# EAGLE board TLog_HighSpeedADC (EAGLE 8.3.0)
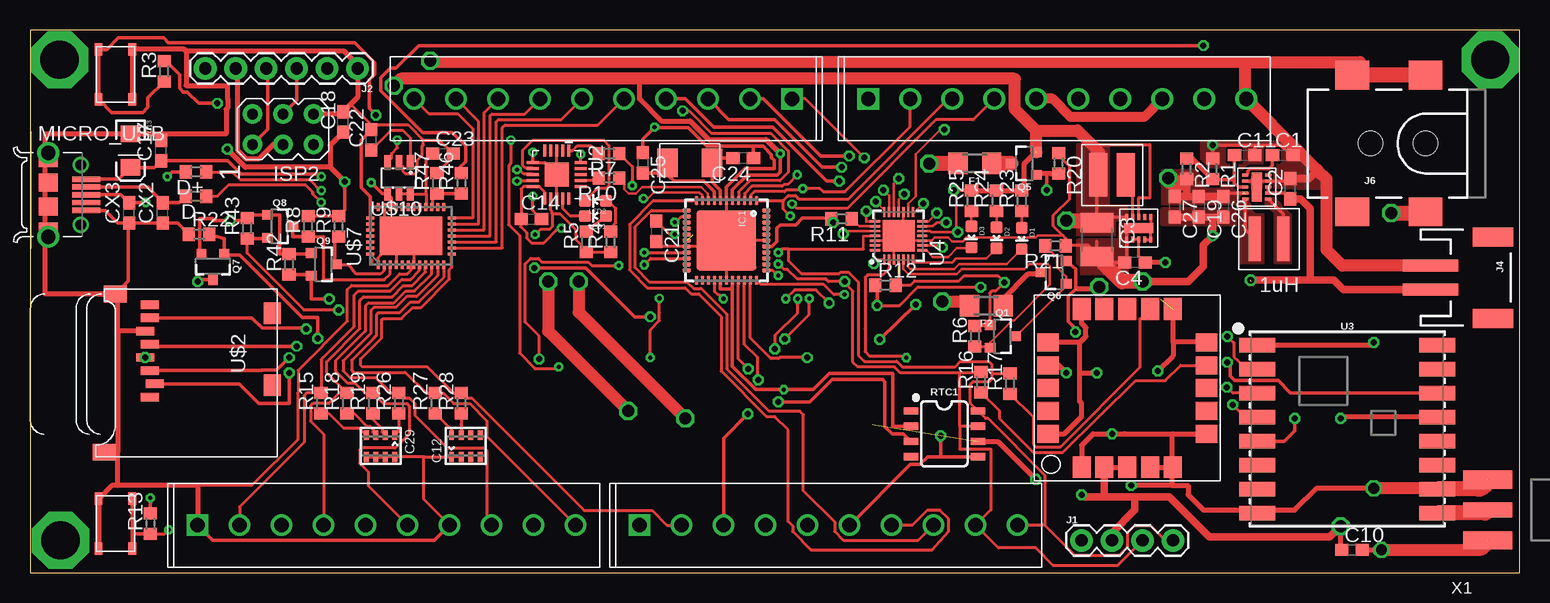
[diagram p7: board, top side]
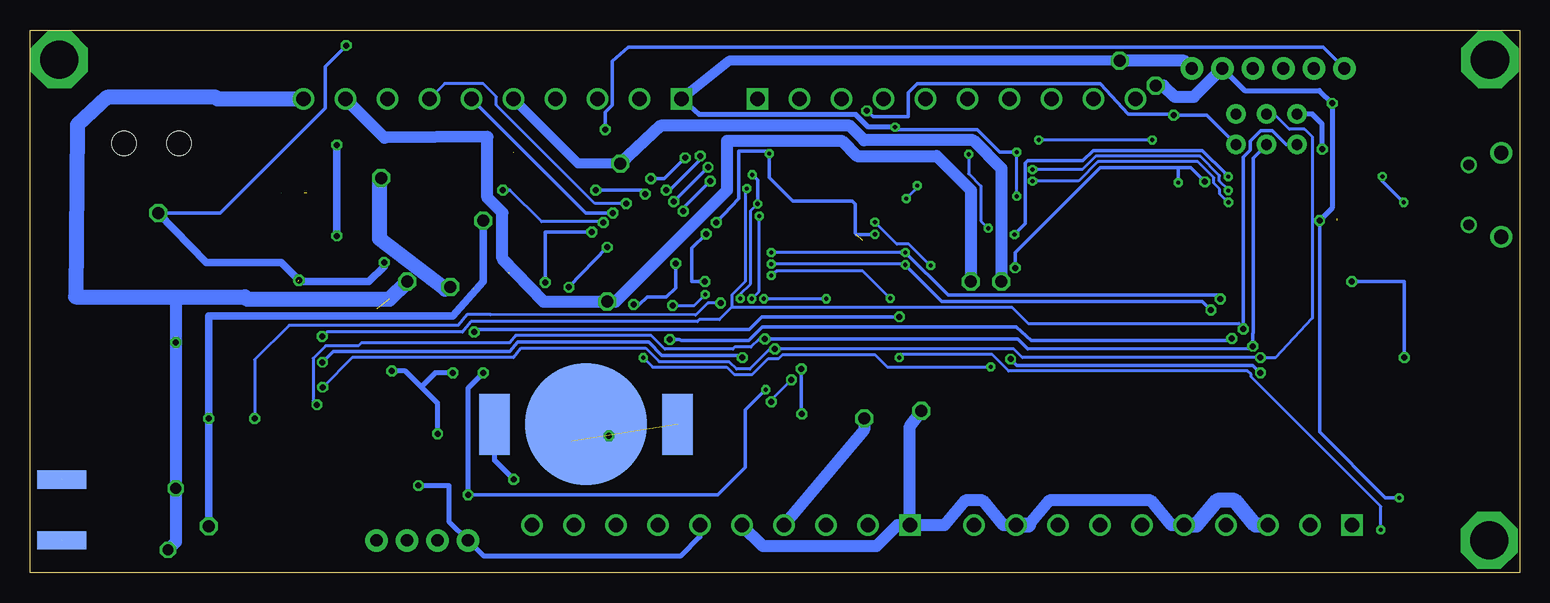
[diagram p8: board, bottom side, seen from below]

Size 124.13 x 45.27 mm. Coordinates in mm from the lower left corner, seen from the top.
Outline: 0,0 124.13,0 124.13,45.27 0,45.27 0,0
Copper layers (1*16): Top 0.0178mm / dielectric 59mil / Bottom 0.0178mm
Design rules "SSC-EAGLE-2Lyr_v1.0.0.3 *": minimum track width 8mil, minimum drill 14mil, track to track 8mil, track to pad 8mil, pad to pad 8mil, via to via 8mil, smd to smd 8mil, copper to edge 20mil, drill to drill 16mil, minimum pad ring 8mil, minimum via ring 8mil, stop-mask expansion 2.5mil, vias tented up to drill 0mil, thermal gap 10mil

## Footprints (pad centres in the part's own frame; a part is rotated, then mirrored left to right if it is on the bottom)
LINX_BAT-HLD-012-SMT = smd 10.16 x 10.16: GND 0,0 | smd 2.54 x 5.08: POWER0 -7.62,0; POWER1 7.62,0
C0603 = smd 1.1 x 1: 1 -0.85,0; 2 0.85,0
C1210 = smd 1.6 x 2.7: 1 -1.4,0; 2 1.4,0
CECJ-1206 = smd 0.406 x 0.813: A1 -1.2,-0.9; A2 -1.2,0.9; B1 -0.4,-0.9; B2 -0.4,0.9; C1 0.4,-0.9; C2 0.4,0.9; D1 1.2,-0.9; D2 1.2,0.9
EIA3216 = smd 1.4 x 1.6: A 1.4,0; C -1.4,0
LED-0603 = smd 1 x 1: A 0,-0.877; C 0,0.877
R0603 = smd 1 x 1.1: 1 -0.85,0; 2 0.85,0
1206 = smd 1.6 x 1.8: 1 -1.4,0; 2 1.4,0
MLF44-TH = smd 0.7 x 0.3: 1 -3.325,2.5; 2 -3.325,2; 3 -3.325,1.5; 4 -3.325,1; 5 -3.325,0.5; 6 -3.325,0; 7 -3.325,-0.5; 8 -3.325,-1; 9 -3.325,-1.5; 10 -3.325,-2; 11 -3.325,-2.5; 23 3.325,-2.5; 24 3.325,-2; 25 3.325,-1.5; 26 3.325,-1; 27 3.325,-0.5; 28 3.325,0; 29 3.325,0.5; 30 3.325,1; 31 3.325,1.5; 32 3.325,2; 33 3.325,2.5 | smd 0.3 x 0.7: 12 -2.5,-3.325; 13 -2,-3.325; 14 -1.5,-3.325; 15 -1,-3.325; 16 -0.5,-3.325; 17 0,-3.325; 18 0.5,-3.325; 19 1,-3.325; 20 1.5,-3.325; 21 2,-3.325; 22 2.5,-3.325; 34 2.5,3.325; 35 2,3.325; 36 1.5,3.325; 37 1,3.325; 38 0.5,3.325; 39 0,3.325; 40 -0.5,3.325; 41 -1,3.325; 42 -1.5,3.325; 43 -2,3.325; 44 -2.5,3.325 | smd 5 x 5: TH 0,0
AVRISP = drill 0.9 pad 1.626: 1 -1.27,2.54; 2 1.27,2.54; 3 -1.27,0; 4 1.27,0; 5 -1.27,-2.54; 6 1.27,-2.54
1X04 = drill 1.016 pad 1.88: 1 0,0; 2 2.54,0; 3 5.08,0; 4 7.62,0
1X06 = drill 1.016 pad 1.88: 1 0,0; 2 2.54,0; 3 5.08,0; 4 7.62,0; 5 10.16,0; 6 12.7,0
JST-2-SMD = smd 1 x 4.6: 1 -1,-3.7; 2 1,-3.7 | smd 1.6 x 3.4: NC1 -3.4,1.5; NC2 3.4,1.5
SCREWTERMINAL-3.5MM-10 = drill 1.2 square: P$1 0,0 | drill 1.2: P$2 3.5,0; P$3 7,0; P$4 10.5,0; P$5 14,0; P$6 17.5,0; P$7 21,0; P$8 24.5,0; P$9 28,0; P$10 31.5,0
POWER_JACK_SMD = smd 2.8 x 2.4: GND 0,-5.7; P$4 6.1,-5.7; VIN0 0,5.7; VIN1 6.1,5.7 | hole 2.032: 0,0; 4.572,0
WE-LQS(INDUCTOR) = smd 1.5 x 3.6: P$1 -1.15,0; P$2 1.15,0
10118194-0001LF_LONGER_PADS = smd 0.45 x 2.35: 1 -1.3,3.175; 2 -0.65,3.175; 3 0,3.175; 4 0.65,3.175; 5 1.3,3.175 | drill 0.9: P$6 -2.5,2.7; P$7 2.5,2.7 | drill 1.2: P$8 -3.5,0; P$9 3.5,0 | smd 1.5 x 1.55: P$10 -1,0; P$11 1,0; P$12 -3.05,0; P$13 3.05,0
SOT23-3 = smd 0.8 x 0.9: 1 -0.95,-1; 2 0.95,-1; 3 0,1.1
SO08 = smd 0.6 x 1.2: 1 -1.905,-2.8; 2 -0.635,-2.8; 3 0.635,-2.8; 4 1.905,-2.8; 5 1.905,2.8; 6 0.635,2.8; 7 -0.635,2.8; 8 -1.905,2.8
QFN20 = smd 1 x 0.25: 1 -2.032,0.968; 2 -2.032,0.468; 3 -2.032,-0.032; 4 -2.032,-0.532; 5 -2.032,-1.032; 11 1.968,-1.032; 12 1.968,-0.532; 13 1.968,-0.032; 14 1.968,0.468; 15 1.968,0.968 | smd 0.25 x 1: 6 -1.032,-2.032; 7 -0.532,-2.032; 8 -0.032,-2.032; 9 0.468,-2.032; 10 0.968,-2.032; 16 0.968,1.968; 17 0.468,1.968; 18 -0.032,1.968; 19 -0.532,1.968; 20 -1.032,1.968 | smd 2 x 2: 21 -0.032,-0.032
RFM69HCW-XXXS2 = smd 3 x 1.2: 1 -7.5,7; 2 -7.5,5; 3 -7.5,3; 4 -7.5,1; 5 -7.5,-1; 6 -7.5,-3; 7 -7.5,-5; 8 -7.5,-7; 9 7.5,-7; 10 7.5,-5; 11 7.5,-3; 12 7.5,-1; 13 7.5,1; 14 7.5,3; 15 7.5,5; 16 7.5,7
QFN-28 = smd 0.85 x 0.2: 1 -1.975,1.2; 2 -1.975,0.8; 3 -1.975,0.4; 4 -1.975,0; 5 -1.975,-0.4; 6 -1.975,-0.8; 7 -1.975,-1.2; 15 1.975,-1.2; 16 1.975,-0.8; 17 1.975,-0.4; 18 1.975,0; 19 1.975,0.4; 20 1.975,0.8; 21 1.975,1.2 | smd 0.2 x 0.85: 8 -1.2,-1.975; 9 -0.8,-1.975; 10 -0.4,-1.975; 11 0,-1.975; 12 0.4,-1.975; 13 0.8,-1.975; 14 1.2,-1.975; 22 1.2,1.975; 23 0.8,1.975; 24 0.4,1.975; 25 0,1.975; 26 -0.4,1.975; 27 -0.8,1.975; 28 -1.2,1.975 | smd 2.65 x 2.65: 29 0,0
CRYSTAL_5X3.2_2-SMD = smd 1.7 x 2.4: P$1 -1.85,0; P$2 1.85,0
MICROSD = smd 0.7 x 1.5: 1 9,-10.64; 2 7.9,-10.24; 3 6.8,-10.64; 4 5.7,-11.04; 5 4.6,-10.64; 6 3.5,-11.04; 7 2.4,-10.64; 8 1.3,-10.64 | smd 1.8 x 1.4: CD1 2,-0.44; CD2 8,-0.44 | smd 1.4 x 1.9: MT1 0.4,-13.54; MT2 13.6,-14.44
WSON-10 = smd 0.5 x 0.25: P$1 -0.95,1; P$2 -0.95,0.5; P$3 -0.95,0; P$4 -0.95,-0.5; P$5 -0.95,-1; P$6 0.95,-1; P$7 0.95,-0.5; P$8 0.95,0; P$9 0.95,0.5; P$10 0.95,1 | smd 0.84 x 2.4: P$11 0,0
SKRPABE010_(SWITCH) = smd 1.05 x 0.65: P$1 -2.075,1.4; P$2 2.075,1.4; P$3 2.075,-1.4; P$4 -2.075,-1.4
SAM-M8Q = smd 1.5 x 1.8: 1 -3.8,-6.6; 2 -1.9,-6.6; 3 0,-6.6; 4 1.9,-6.6; 5 3.8,-6.6; 11 3.8,6.6; 12 1.9,6.6; 13 0,6.6; 14 -1.9,6.6; 15 -3.8,6.6 | smd 1.8 x 1.5: 6 6.6,-3.8; 7 6.6,-1.9; 8 6.6,0; 9 6.6,1.9; 10 6.6,3.8; 16 -6.6,3.8; 17 -6.6,1.9; 18 -6.6,0; 19 -6.6,-1.9; 20 -6.6,-3.8
QFN38-5X7 = smd 0.7 x 0.25: 1 -2.4,2.75; 2 -2.4,2.25; 3 -2.4,1.75; 4 -2.4,1.25; 5 -2.4,0.75; 6 -2.4,0.25; 7 -2.4,-0.25; 8 -2.4,-0.75; 9 -2.4,-1.25; 10 -2.4,-1.75; 11 -2.4,-2.25; 12 -2.4,-2.75; 20 2.4,-2.75; 21 2.4,-2.25; 22 2.4,-1.75; 23 2.4,-1.25; 24 2.4,-0.75; 25 2.4,-0.25; 26 2.4,0.25; 27 2.4,0.75; 28 2.4,1.25; 29 2.4,1.75; 30 2.4,2.25; 31 2.4,2.75 | smd 0.25 x 0.7: 13 -1.5,-3.4; 14 -1,-3.4; 15 -0.5,-3.4; 16 0,-3.4; 17 0.5,-3.4; 18 1,-3.4; 19 1.5,-3.4; 32 1.5,3.4; 33 1,3.4; 34 0.5,3.4; 35 0,3.4; 36 -0.5,3.4; 37 -1,3.4; 38 -1.5,3.4 | smd 3.2 x 5.2: EXP 0,0
WE-MAIA(4.1X4.1) = smd 0.98 x 3.7: P$1 -1.185,0; P$2 1.185,0
SOT23-6L = smd 0.55 x 1.2: 1 -0.95,-1.3; 2 0,-1.3; 3 0.95,-1.3; 4 0.95,1.3; 5 0,1.3; 6 -0.95,1.3
SSOP16 = smd 0.419 x 1.143: 1 -2.223,-2.6; 2 -1.587,-2.6; 3 -0.953,-2.6; 4 -0.318,-2.6; 5 0.318,-2.6; 6 0.953,-2.6; 7 1.587,-2.6; 8 2.223,-2.6; 9 2.223,2.6; 10 1.587,2.6; 11 0.953,2.6; 12 0.318,2.6; 13 -0.318,2.6; 14 -0.953,2.6; 15 -1.587,2.6; 16 -2.223,2.6
SMA_EDGELAUNCH = smd 4.064 x 1.524: GND@1 2.032,-2.54; GND@2 2.032,2.54 | smd 4.064 x 1.524 bottom: GND@3 2.032,2.54; GND@4 2.032,-2.54 | smd 4.064 x 1.27: P 2.032,0

## Placement (x,y rotation side)
BT1  LINX-BAT-HLD-012-SMT-OTL  [LINX_BAT-HLD-012-SMT]  77.79,12.38 0 bottom
C1  0.1uF  [C0603]  104.39,34.83 0 top
C2  10uF  [C0603]  105.03,32.04 90 top
C3  22uF  [C1210]  88.9,27.78 270 top
C4  2.2uF  [C0603]  92.08,25.88 180 top
C10  0.1uF  [C0603]  110.17,1.9 0 top
C11  10pF  [C0603]  101.22,34.83 0 top
C12  10nF  [CECJ-1206]  36.32,10.57 0 top
C13  10uF  [EIA3216]  8.38,35.21 270 top
C14  0.1uF  [C0603]  41.78,29.5 0 top
C17  0.1uF  [C0603]  10.92,35.21 90 top
C18  .1uF  [C0603]  26.1,37.59 90 top
C19  22uF  [C0603]  97.41,30.51 270 top
C21  1uF  [C0603]  52.2,28.48 270 top
C22  0.1uF  [C0603]  28.45,36.1 90 top
C23  0.1uF  [C0603]  34.42,34.96 0 top
C24  [C0603]  59.44,34.58 180 top
C25  [C0603]  51.05,34.19 270 top
C26  22uF  [C0603]  99.44,30.51 270 top
C27  22uF  [C0603]  95.38,30.51 270 top
C29  10nF  [CECJ-1206]  29.21,10.57 180 top
CX2  33pF  [C0603]  11.05,30 90 top
CX3  33pF  [C0603]  8.25,30 90 top
D1  [LED-0603]  82.65,27.88 180 top
D2  [LED-0603]  80.55,27.94 180 top
D3  [LED-0603]  78.45,28 180 top
D+  27ohm  [R0603]  13.84,33.43 180 top
D-  27ohm  [R0603]  13.84,31.4 180 top
F1  6V/0.5A  [1206]  78.74,34.13 180 top
F2  6V/0.5A  [1206]  79.69,22.26 180 top
IC1  ATMEGA644M  [MLF44-TH]  58.04,27.72 270 top
ISP2  AVRISP-6  [AVRISP]  21.08,36.99 90 top
J1  [1X04]  87.63,2.7 0 top
J2  [1X06]  27.3,42.07 180 top
J4  [JST-2-SMD]  120.41,24.61 270 top
J5  [SCREWTERMINAL-3.5MM-10]  63.5,39.53 180 top
J6  5.5x2.1mm Barrel  [POWER_JACK_SMD]  116.28,35.8 180 top
J8  [SCREWTERMINAL-3.5MM-10]  13.97,3.97 0 top
J9  [SCREWTERMINAL-3.5MM-10]  50.8,3.97 0 top
J10  [SCREWTERMINAL-3.5MM-10]  69.85,39.53 0 top
L2  10uH  [WE-LQS(INDUCTOR)]  90.17,33.18 180 top
LED1  Yellow  [LED-0603]  47.12,29.75 90 top
LED2  Blue  [LED-0603]  47.12,31.02 90 top
MICRO_USB  10118194-0001LF_LONGER_PADS  [10118194-0001LF_LONGER_PADS]  1.52,31.53 270 top
Q1  220mA/50V/3.5Ω  [SOT23-3]  81.03,19.72 270 top
Q5  4.3A/20V/54mΩ  [SOT23-3]  82.87,34.13 90 top
Q6  4.3A/20V/54mΩ  [SOT23-3]  85.34,25.05 90 top
Q7  4.3A/20V/54mΩ  [SOT23-3]  15.24,25.56 180 top
Q8  220mA/50V/3.5Ω  [SOT23-3]  20.8,28.89 270 top
Q9  220mA/50V/3.5Ω  [SOT23-3]  24.45,25.72 270 top
R1  143k  [R0603]  98.55,33.69 270 top
R2  953k  [R0603]  96.39,33.69 270 top
R3  10k  [R0603]  11.18,41.81 90 top
R4  1k  [R0603]  48.39,27.59 90 top
R5  1k  [R0603]  46.35,27.59 90 top
R6  10k  [R0603]  78.74,19.72 90 top
R7  1k  [R0603]  48.26,34.96 180 top
R8  10k  [R0603]  23.18,28.89 90 top
R9  10k  [R0603]  25.72,28.89 90 top
R10  1k  [R0603]  48.26,32.92 180 top
R11  10k  [R0603]  67.63,29.53 180 top
R12  10k  [R0603]  71.28,23.97 0 top
R13  10k  [R0603]  10.03,4.1 90 top
R15  10k  [R0603]  24.26,14.13 90 top
R16  FB  [R0603]  79.25,15.91 90 top
R17  FB  [R0603]  81.66,15.78 90 top
R18  10k  [R0603]  26.42,14.13 90 top
R19  10k  [R0603]  28.58,14.13 90 top
R20  10k  [R0603]  85.73,34.13 270 top
R21  10k  [R0603]  85.47,27.27 180 top
R22  10k  [R0603]  14.1,28.23 0 top
R23  330  [R0603]  82.65,31.04 90 top
R24  330  [R0603]  80.55,31.04 90 top
R25  330  [R0603]  78.45,31.04 90 top
R26  10k  [R0603]  30.73,14.13 90 top
R27  10k  [R0603]  33.78,14.13 90 top
R28  10k  [R0603]  35.94,14.13 90 top
R42  10k  [R0603]  21.59,25.72 90 top
R43  10k  [R0603]  18.1,28.73 90 top
R46  10k  [R0603]  35.94,32.48 90 top
R47  10k  [R0603]  33.91,32.48 90 top
RTC1  DS3231M  [SO08]  76.2,11.59 270 top
U2  FT231X-Q  [QFN20]  43.94,33.18 270 top
U3  915MHz  [RFM69HCW-XXXS2]  109.78,11.99 0 top
U4  SX1509  [QFN-28]  72.39,28.1 90 top
U$1  CRYSTAL_5X3.2_2LEAD  [CRYSTAL_5X3.2_2-SMD]  54.99,34.19 0 top
U$2  MICROSD  [MICROSD]  20.64,23.65 270 top
U$3  TPS63061  [WSON-10]  102.23,32.16 180 top
U$4  TPS6217X  [WSON-10]  92.39,28.73 90 top
U$5  SKRPABE010  [SKRPABE010_(SWITCH)]  7.11,4.1 90 top
U$6  SAM-M8Q  [SAM-M8Q]  91.44,15.4 0 top
U$7  LTC2495  [QFN38-5X7]  31.75,28.1 90 top
U$8  1uH  [WE-MAIA(4.1X4.1)]  103.25,27.84 180 top
U$9  SKRPABE010  [SKRPABE010_(SWITCH)]  7.11,41.56 270 top
U$10  MAX6070  [SOT23-6L]  30.73,32.92 180 top
U$15  LTC2440  [SSOP16]  -11.94,-2.13 0 top  (outside the outline)
X1  [SMA_EDGELAUNCH]  123.51,5.24 180 top

## Tracks (layer width: path | path; a pad name or v marks a point on that pad's centre or on a via)
3.3V  (via drill 0.35, 0.5, 0.5 pad 0.2, 1)  (3 unrouted)
  Top 0.203: U4.18 72.39,31.11 v72.87,31.59 | U4.4 72.39,23.97 | v77.31,28.42 77.17,28.43 77.17,31.89 | 77.31,28.5 v77.31,28.42 | U4.12 75.01,28.5 75.09,28.42 v77.31,28.42
  Top 0.254: U$4.P$8 92.39,31.27 93.34,31.27 93.34,35.72 89.02,35.72 | 72.39,23.97 73.34,23.97 73.71,24.34 77.42,24.34 77.85,24.78 80.65,24.78 v81.2,24.21 80.48,23.49 80.16,23.49 79.96,23.29 79.96,20.6 | R6.2 79.93,20.57 79.96,20.6 | 79.96,20.6 Q1.1 | v53.72,28.23 53.3,28.23 C21.1
  Top 0.305: U$4.P$10 89.4,29.68 C3.1 88.9,29.37 88.9,33.18 L2.P$2 89.02,34.45 89.02,35.15 89.02,35.72 | RTC1.2 71.91,12.22 71.91,16.61 66.61,16.61 65.26,15.27 v62.81,15.27 60.48,15.27 58.54,17.21 58.54,23.65 | Q9.1 23.45,26.57 R42.2 20.8,26.57 20.8,29.84 Q8.1 18.1,29.84 R43.2 18.1,29.37 v16.67,29.37 15.24,29.37 | Q7.2 14.13,26.56 14.13,29.53 15.24,29.53 | R25.2 78.32,31.91 v76.99,31.91 77.17,31.89 | 72.39,23.97 R12.2 | R11.2 66.94,29.37 v66.94,29.21 66.79,29.53 66.11,29.57 64.36,29.57 63.8,29.02 62.51,29.02 62.23,28.73 62.23,27.62 61.82,27.22 IC1.38 | 58.54,23.65 IC1.29 | IC1.27 57.54,23.65 58.54,23.65 | IC1.5 | 58.56,31.04 IC1.5 | v62.52,34.95 62.52,33.42 62.28,33.18 59.78,33.18 58.54,31.94 IC1.5 | v15.62,39.15 14.06,39.15 13.12,40.08 12.79,40.08 12.46,40.41 12.46,41.56 11.35,42.66 R3.2 | v10.03,6.25 R13.2
  Top 0.406: 50.8,41.21 50.8,40.08 50.81,40.07 50.81,39.52 52.64,37.68 55.02,37.68 56.57,36.13 61.34,36.13 v62.52,34.95 | R24.2 R25.2 R23.2 82.87,31.81 82.87,34.13 83.82,35.08 | C10.1 109.22,2.01 v109.22,3.89 | U3.13 109.22,12.99 v109.22,12.86 | 89.31,6.35 89.54,6.58 | U$6.2 U$6.3 | U$6.17 85.73,17.3 v86.36,16.67
  Top 0.61: v109.22,3.89 108.33,3.02 98.27,3.02 94.93,6.35 92.08,6.35 | 92.08,6.35 89.31,6.35 87.79,6.35 v87.63,6.51 | J1.2 90.17,3.33 92.08,5.24 92.08,6.35 | 89.54,6.58 U$6.2
  Top 1.016: v30.32,40.64 30.89,41.21 50.8,41.21 82.07,41.21 82.07,38.65 83.87,36.87 | Q5.2 83.87,36.87 | 83.87,36.87 87.3,36.87 89.02,35.15
  Top 1.27: v86.36,29.37 88.9,29.37 | 89.02,34.98 89.02,34.45
  Bottom 0.305: J2.2 | v16.67,29.37 16.67,11.75 11.18,6.25 v10.03,6.25 | v72.87,31.59 73.18,31.91 v76.99,31.91 | v81.2,24.21 81.2,28.42 v77.31,28.42 | v66.94,29.21 65.09,31.22 65.09,35.16 62.74,35.16 v62.52,34.95 62.52,32.96 60.58,31.02 55.63,31.02 55.37,30.77 55.37,28.31 55.28,28.23 v53.72,28.23 | v62.81,15.27 64.52,13.57 64.52,8.79 66.8,6.51 v87.63,6.51
  Bottom 0.406: J2.2 22.92,40.22 16.69,40.22 v15.62,39.15 15.62,30.42 v16.67,29.37 | v86.36,16.67 87.63,15.4 v87.63,6.51
  Bottom 0.61: v109.22,3.89 v109.22,12.86 109.22,21.43 88.9,21.43 86.36,24.29 v86.36,29.37
  Bottom 1.016: v30.32,40.64 29.69,40.64 28.73,39.69 27.15,39.69 J2.2
  pour Top (rank 2, no thermals): 91.44,28.1 87.31,28.1 87.31,35.72 89.85,35.72 89.85,30.64 91.44,30.64
3.3V_EXT_CTRL  (via drill 0.5)
  Top 0.203: U4.13 75.24,28.9 75.56,29.21 75.87,29.21 v76.36,29.19
  Top 0.305: v84.73,31.91 84.73,33.28 85.09,33.28
  Top 0.406: R20.2 85.09,33.28 83.87,33.28 Q5.1
  Bottom 0.254: 84.14,31.91 81.5,29.27 76.36,29.27 v76.36,29.19
  Bottom 0.305: 84.14,31.91 v84.73,31.91
5V  (via drill 0.35, 0.5, 1)  (2 unrouted)
  Top 0.254: U$7.29 30.33,30.5 U$7.28
  Top 0.305: R8.2 R9.2 26.23,30.25 v26.23,32.61 | v42.04,25.43 46.32,25.43 50.4,21.35 v51.67,21.35 | v87.12,20.08 87.12,20.36 86.53,20.95 86.53,23.07 87.15,23.68 87.15,25.32 Q6.2 | C26.1 99.73,31.65 101.06,31.65 | v28.45,32.54 29.37,31.62 U$10.4 30.1,31.31 30.1,30.88 30.33,30.65 30.33,30.5
  Top 0.406: 25.02,33.81 v26.23,32.61 | v16.45,35.32 17.96,33.81 25.02,33.81 | v89.09,23.84 88.93,23.68 87.2,23.68 | C18.1 25.02,35.66 25.02,33.81
  Top 0.61: 96.59,31.36 C27.1 | 96.59,31.36 C19.1 C26.1 | R2.2 96.39,31.55 96.59,31.36
  Top 1.27: v94.87,32.92 94.87,32.8 95,32.8 95,32.67 95.12,32.54 96.1,32.54 R2.2
  Bottom 0.305: v51.67,21.35 62.95,21.35 63.14,21.35 64.2,20.3 86.9,20.3 v87.12,20.08 | v42.04,25.43 42.04,26.7 34.94,33.8 28.45,33.8 | v26.23,32.61 27.42,33.8 28.45,33.8 | 28.45,33.8 v28.45,32.54
  Bottom 0.406: v16.45,35.32 16.45,37.43 17.27,38.26 ISP2.2
  Bottom 1.27: v89.09,23.84 89.28,23.72 89.54,23.65 95,27.84 95,32.8 v94.87,32.92
  pour Top (rank 2, no thermals): 101.6,31.91 100.58,31.91 100.58,32.16 100.2,32.54 97.41,32.54 97.41,33.56 94.36,33.56 94.36,30.51 100.46,30.51 100.46,31.27 101.6,31.27
5V_EXT_CTRL
  Top 0.2: 81.92,25.32 81.99,25.32 82.01,25.31 82.05,25.32 82.87,25.32 83.3,25.75 84.82,25.75 85,25.58 85,24.03 82.02,21.05 81.86,21.05 80.03,19.22 Q1.2
  Top 0.203: U4.5 72.79,25.32 73.18,24.92 77.23,24.92 77.47,25.16 77.63,25.32 | 77.63,25.32 81.92,25.32 | 77.63,25.32 | 77.63,25.32 | 77.63,25.32
  Top 0.254: R6.1 79.93,18.87 Q1.2
ADC0
  Top 0.254: U$7.8 32.46,25.66 32.46,25.21 31.71,24.47 30.99,24.47 30,23.48 27.35,23.48 27.03,23.17 27.03,20.55 24.26,17.77 R15.2 23.05,14.98 22.84,14.76 22.84,10.88 17.47,5.52 J8.P$2
ADC1
  Top 0.254: U$7.9 32.96,25.66 32.96,25.07 31.84,23.95 31.12,23.95 30.19,23.02 27.8,23.02 27.49,22.7 27.49,20.36 24.71,17.58 24.71,16.68 R18.2 25.77,14.98 24.9,14.11 23.57,14.11 23.38,13.92 23.38,12.64 24.47,11.55 J8.P$4
ADC2
  Top 0.254: U$7.10 33.46,25.66 33.46,24.93 32.03,23.49 31.3,23.49 30.32,22.51 28.19,22.51 27.94,22.26 27.94,20.16 25.45,17.67 25.45,16.85 26.49,15.81 27.1,15.81 27.93,14.98 R19.2 29.45,14.11 31.42,14.11 31.61,13.92 31.61,11.6 30.42,10.41 27.67,10.41 27.48,10.22 27.48,9.13 28.19,8.41 28.19,7.24 J8.P$6
ADC3
  Top 0.254: U$7.11 34,24.82 32.22,23.03 31.38,23.03 30.48,22.13 28.65,22.13 28.4,21.88 28.4,20.35 | 28.4,20.35 | 28.4,20.35 28.4,19.97 26.09,17.67 26.09,16.85 26.68,16.27 28.8,16.27 30.09,14.98 R26.2 31.15,14.57 31.61,14.57 32.07,14.1 32.07,13.12 34.78,10.41 37.86,10.41 38.05,10.22 38.05,4.38 J8.P$8
ADC4
  Top 0.203: U$7.12 34.5,25.59 34.53,25.56
  Top 0.254: 34.5,25.59 34.5,24.67 32.41,22.58 31.68,22.58 30.78,21.67 29.01,21.67 28.85,21.52 28.85,19.78 28.59,19.52 | 28.59,19.52 | 28.59,19.52 26.8,17.73 26.8,16.92 27,16.72 31.27,16.72 33.01,14.98 R27.2 34.42,14.98 35.29,14.11 36.63,14.11 38.05,12.68 38.05,11.38 J8.P$10
ADC5
  Top 0.254: U$7.13 35.15,25.5 34.96,25.3 34.96,24.48 32.59,22.12 31.88,22.12 30.95,21.19 29.41,21.19 29.31,21.09 29.31,19.59 27.56,17.84 27.56,17.3 27.68,17.18 33.1,17.18 35.3,14.98 R28.2 36.35,14.57 36.82,14.57 46.18,5.2 51.84,5.2 53.07,3.97 J9.P$2
ADC6
  Top 0.254: U$7.14 39.37,27.1 39.37,37.12 39.6,37.34 47.32,37.34 J5.P$5
ADC7
  Top 0.254: U$7.15 38.86,27.6 38.86,37.62 39.04,37.8 44.27,37.8 J5.P$6
ADC8
  Top 0.254: U$7.16 38.35,28.1 38.35,38.13 38.48,38.26 41.23,38.26 J5.P$7
ADC9
  Top 0.254: U$7.17 37.85,28.6 37.85,38.37 J5.P$8
ADC10
  Top 0.254: U$7.18 37.39,29.1 37.39,37.64 J5.P$9
ADC11
  Top 0.254: U$7.19 35.17,29.62 36.93,29.62 36.93,37.01 35.69,38.26 33.27,38.26 J5.P$10
BATT+  (via drill 0.5, 0.55, 1)  (2 unrouted)
  Top 0.254: U$4.P$2 U$4.P$3 92.39,26.41 C4.1
  Top 0.305: 92.71,25.88 C4.1 | v97.79,43.97 32.38,43.97 30.48,42.07 30,42.07 29.21,41.27 29.21,40.23 32.74,36.7 35.2,36.7 36.3,35.6 36.3,34.31 35.69,33.7 R46.2 | C2.1 104.54,31.67 U$3.P$2 | U$3.P$2 U$3.P$3
  Top 0.406: v94.62,25.88 92.71,25.88 | 106.68,24.41 106.69,24.4
  Top 0.61: J4.2 109.45,23.61 108.66,24.4 106.69,24.4 v101.73,24.4 | C2.1 105.88,31.19 106.68,30.38 106.68,24.41
  Top 1.27: v113.43,30 115.11,30.02 J6.VIN0
  Bottom 0.305: v113.43,30 108.27,30 99.54,38.73 99.54,42.23 v97.79,43.97
  Bottom 0.61: 101.76,24.29 95.89,24.29 94.62,25.56 v94.62,25.88 | v113.43,30 109.46,25.88 103.2,25.88 v101.73,24.4
EXT_3.3V  (via drill 1)
  Top 0.813: 77.58,34.13 F1.2 | J10.P$8 92.84,38.02 86.73,38.02 85.22,39.53 J10.P$5
  Top 1.016: v43.18,24.29 43.18,20.16 v49.85,13.49
  Top 1.27: F1.2 v74.93,34.13
  Bottom 0.813: 74.95,34.13 78.45,34.13 J10.P$5
  Bottom 1.016: v74.93,34.13 74.95,34.13 71.57,37.27 55.82,37.27 54.63,36.08 45.54,36.08 43.18,33.72 v43.18,24.29 | v49.85,13.49 50.8,12.23 J9.P$1 | J8.P$5 29.01,3.97 30.75,6.04 39.19,6.04 40.93,3.97 | J8.P$9 43.01,3.97 44.75,6.04 46.19,6.04 47.93,3.97 J9.P$1 | J9.P$5 63.06,2.23 53.58,2.23 51.84,3.97 J9.P$1
  Bottom 1.27: J8.P$3 22.01,3.97 23.75,6.04 25.19,6.04 26.93,3.97 J8.P$5 | 40.93,3.97 J8.P$9
EXT_5V  (via drill 1)
  Top 1.016: v45.72,24.29 45.72,21.75 v54.61,12.86 | v76.04,22.62 78.29,22.62 F2.2
  Bottom 1.016: v45.72,24.29 45.72,31.91 48.58,34.77 55.22,34.77 56.49,36.04 66.04,36.04 66.04,31.91 75.33,22.62 v76.04,22.62 81.34,22.62 84.77,26.22 84.77,30.03 86.02,31.27 86.02,36.35 94.6,36.27 J10.P$9 | v54.61,12.86 54.61,11.93 J9.P$4
EXT_D6  (via drill 0.5)
  Top 0.203: U4.15 73.73,30.07 v74.45,30.8
  Bottom 0.254: v74.45,30.8 77.05,30.8 85.26,39.01 85.26,39.7 86.36,40.8 89.58,40.8 J10.P$7
EXT_INT  (via drill 0.5)
  Top 0.254: v59.85,17 59.04,17.81 IC1.30
  Top 0.305: J9.P$3 57.8,11.22 v59.82,13.24
  Bottom 0.305: v59.85,17 59.85,13.27 v59.82,13.24
GND  (via drill 0.35, 0.5, 0.5 pad 0.2, 0.9, 0.9 pad 0.2, 1)  (3 unrouted)
  Top 0.152: 42.02,34.21 U2.6
  Top 0.2: 83.48,27.94 83.81,27.94 84,28.13 86.08,28.13 | 86.08,28.13
  Top 0.203: U4.26 71.99,27.7 U4.3 | 72.79,27.7 U4.10 75.17,27.7 75.41,27.94 76.52,27.94 76.84,27.62 77.71,27.62 78.03,27.94 83.48,27.94 | U4.17 72.79,28.5
  Top 0.254: U$4.P$6 93.39,28.73 U$4.P$5 U$4.P$4 | 31.75,25.7 U$7.6 | 31.75,25.7 U$7.7 32,27.85 | 30.5,26.81 U$7.4 | U$7.1 29,26.27 30.83,28.1 | U$7.30 29.5,28.1 | 31.75,25.7 31.75,25.24 31.43,24.92 30.8,24.92 29.85,23.97 26.81,23.97 26.45,23.61 26.45,20.99 22.35,16.89 22.35,15.04 22.3,14.98 22.3,11.1 18.47,7.27 13.97,7.27 | C29.D2 C29.C2 C29.B2 C29.A2 32.83,9.67 | C12.B1 C12.A1 32.83,9.67 | J8.P$7 32.83,6.11 32.83,9.67 | 58.04,27.2 IC1.TH | 58.04,27.2 IC1.28 | IC1.39 IC1.TH | 58.04,27.2 58.02,27.22 IC1.18 52.61,27.22 C21.2 | IC1.6 IC1.TH | R20.1 85.73,34.8 86.61,33.92 86.61,31.14 85.28,29.82 85.28,28.92 86.08,28.13 86.32,27.88 R21.1 88.22,27.27 88.9,26.59 | U2.6 42.91,34.21 43.81,33.31 | 43.81,33.31 U2.21 | 43.91,33.41 U2.3 | 43.91,33.41 43.81,33.31 | U2.13 43.91,33.41 | R47.2 35.27,34.69 C23.2 34.12,36.1 32.78,36.1 | 26.74,39.08 28.45,37.37 C22.2 28.87,37.37 31.51,37.37 32.78,36.1 | U$10.2 31.08,33.88 31.08,33.49 31.27,33.29 32.1,33.29 32.29,33.49 32.29,34.43 32.69,34.83 32.69,35.59 32.78,35.69 32.78,36.1 | C14.2 41.91,30.22 v41.91,31.4
  Top 0.305: 93.39,28.73 U$4.P$11 91.39,28.73 U$4.P$1 91.38,26.35 C4.2 89.41,25.88 C3.2 88.9,26.59 88.9,27.62 | 30.5,26.81 30.48,26.83 U$7.EXP | 32,27.85 U$7.EXP | 30.83,28.1 U$7.EXP | U$7.30 U$7.31 28.35,30.5 | 28.35,30.5 U$7.32 U$7.33 U$7.34 | 29.5,28.1 U$7.EXP | U$2.MT2 7.3,10.05 | 7.3,23.02 7.1,23.02 U$2.MT1 8.17,24.33 8.17,29.15 | 75.88,9.68 RTC1.5 | J8.P$7 33.7,2.7 15.24,2.7 J8.P$1 | U4.29 72.39,27.7 71.99,27.7 U4.29 | 72.79,27.7 U4.29 | 72.79,28.5 U4.29 | 75.88,9.68 v75.88,11.43 | C2.2 104.81,32.67 U$3.P$4 | 105.75,35.13 105.45,34.83 C1.2 105.1,34.83 104.24,35.69 102.07,35.69 | R1.1 v98.55,35.69 102.07,35.69 | C11.2 102.07,35.69 | U$3.P$7 102.23,32.66 | U$3.P$4 102.23,32.66 | 102.23,32.66 U$3.P$11 | J9.P$6 73.36,9.03 74.15,9.03 74.8,9.68 75.88,9.68 | IC1.6 58.04,32.16 59.57,33.69 62.01,33.69 62.01,34.42 61.79,34.64 61.79,34.89 61.11,35.57 60.29,35.57 | C25.1 51.05,36.17 v52.05,37.17 52.37,37.17 52.41,37.13 54.85,37.13 56.41,35.57 60.28,35.57 60.29,35.57 | C24.1 60.29,35.57 | R22.1 12.32,29.15 CX2.1 CX3.1 8.17,29.15 | 8.17,29.15 7.33,29.15 6.25,30.23 MICRO_USB.5 | U2.6 v41.91,35.08 | 28.35,30.5 28.35,31.38 27.59,32.14 27.59,36.09 C22.2
  Top 0.406: U3.8 102.64,5.24 arc90 U3.8 | 95.15,7.27 v91.76,7.27 | 95.15,7.27 96.52,7.27 96.52,6.51 97.79,5.24 102.28,5.24 | 7.3,20.15 7.3,10.05 7.3,7.27 | 7.3,20.15 7.3,23.02 | U$2.6 7.3,20.15 | 5.67,23.25 U$2.MT1 1.27,23.25 1.27,36.61 C13.C 10.97,36.61 | C10.2 v112.63,1.9 | 13.02,43.5 26.19,43.5 27.3,42.39 J2.1 27.3,39.65 26.74,39.08 C18.2 25.92,38.26 ISP2.6 | 13.02,43.5 13.02,40.64 16.45,40.64 16.45,39.54 16.48,39.5 16.48,38.79 16.35,38.66 16.35,36.61 10.97,36.61 | v111.98,7.05 107.24,7.05 105.41,5.24 102.28,5.24 | 102.28,5.24 U3.8 | U3.1 111.98,18.99 v111.98,19.21 | 95.15,8.71 U$6.5 U$6.4 | 95.15,8.71 95.15,7.27 | U$6.11 95.25,21.75 95.25,19.24 | U$6.16 84.86,19.22 87.47,19.22 | U$6.15 87.64,20.78 87.98,20.44 87.98,19.73 87.48,19.22 87.47,19.22 | U$6.20 86.2,11.6 87.63,13.03 87.63,14.13 87.47,14.29 87.47,16.67 | U$6.1 87.64,10.63 88.6,11.59 v90.17,11.59 91.2,11.59 91.2,11.6 95.25,11.6 | 87.47,16.67 87.47,19.22 | v93.98,16.82 95.25,18.09 95.25,19.24 | U$6.10 98,19.24 95.25,19.24 | 95.25,11.6 U$6.6 | 95.25,11.6 95.15,11.5 95.15,8.71 | 87.47,16.67 v88.9,16.67 | U$9.P$2 U$9.P$1 8.53,43.65 12.86,43.65 13.02,43.5 | U$5.P$1 U$5.P$2 6.82,7.27 7.3,7.27 | J8.P$1 13.97,7.27 7.3,7.27 | C17.2 10.97,36.11 10.97,36.61
  Top 0.61: v92.71,24.29 96.52,24.29 97.79,25.56 97.79,27.34 v98.55,28.1 98.55,29.59 98.48,29.66 | C2.2 106.57,32.89 107.28,33.6 | 98.48,29.66 C19.2 C27.2 | 98.48,29.66 C26.2
  Top 1.016: v33.34,42.7 33.93,42.58 101.28,42.58 | J6.P$4 110.84,42.58 101.28,42.58 | 101.28,42.58 101.28,39.6 J10.P$10 105.75,35.13 107.28,33.6 108.04,32.84 108.04,26.92 109.36,25.61 J4.1 | v112.63,1.9 120.68,1.9 arc90 X1.GND@2 | U3.10 arc90 117.21,7.05 v111.98,7.05
  Top 1.27: v92.71,24.29 90.99,24.29 89.41,25.88 | J6.GND J6.P$4 | X1.GND@1 arc-90 120.68,6.99 U3.10
  Bottom 0.254: v41.91,31.4 v41.91,35.08
  Bottom 0.305: v75.88,11.43 77.79,11.43 BT1.GND | v41.91,35.08 43.33,35.08 45.19,36.94 51.82,36.94 v52.06,37.18
  Bottom 0.406: v91.76,7.27 89.22,7.27 89.22,4.29 J1.1 86.36,1.43 69.85,1.43 68.3,2.98 J9.P$6 | J10.P$1 68.38,38.22 55.3,38.22 54.26,37.18 v52.06,37.18 v52.05,37.17 | v93.98,16.82 92.86,16.82 91.54,15.49 | v90.17,11.59 90.17,14.13 91.54,15.49 | v88.9,16.67 90.36,16.67 91.54,15.49
  Bottom 0.61: 111.98,22.8 111.76,23.02 | v98.55,28.1 v98.55,35.69
  Bottom 0.813: v33.34,42.7 65.88,42.7 J10.P$1
  Bottom 1.016: v33.34,42.7 27.94,42.7 J2.1 | 111.98,22.8 v111.98,19.21 v111.98,7.05 111.98,2.56 v112.63,1.9
  Bottom 1.27: v92.71,24.29 94.18,22.82 106.02,22.82 106.22,23.02 120.33,23.02 120.17,37.35 117.71,39.66 108.62,39.66 108.5,39.53 J10.P$10
  pour Top (no thermals): 87.31,27.78 90.81,27.78 90.81,29.05 91.44,29.05 91.44,24.92 87.31,24.92
  pour Top (no thermals): 101.09,33.56 100.84,33.81 97.66,33.81 97.66,35.97 105.28,35.97 108.33,32.04 101.09,32.04
  pour Top (no thermals): 94.36,30.38 100.46,30.38 100.46,28.99 94.36,28.99
GPIO_EXT1  (via drill 0.5)
  Top 0.203: U4.19 71.99,32.46 v72.39,32.86
  Top 0.254: v69.53,34.61 64.61,39.53 J5.P$1
  Bottom 0.305: v72.39,32.86 71.28,32.86 v69.53,34.61
GPIO_EXT2  (via drill 0.5)
  Top 0.203: U4.20 71.59,31.44 v71.12,31.91
  Top 0.305: v68.26,34.77 65.88,34.77 61.12,39.53 J5.P$2
  Bottom 0.305: v71.12,31.91 70.8,31.91 68.26,34.45 v68.26,34.77
GPIO_EXT3  (via drill 0.5)
  Top 0.203: U4.21 71.19,30.25 v70.48,30.96
  Top 0.305: v67.63,33.81 66.04,33.81 62.07,37.78 58.25,37.78 J5.P$3
  Bottom 0.305: v70.48,30.96 v67.63,33.81
GPIO_EXT4  (via drill 0.5)
  Top 0.203: U4.22 69.69,29.3 v69.69,30.16
  Top 0.305: v67.43,32.66 66.4,32.66 61.91,37.15 56.99,37.15 54.61,39.53 J5.P$4
  Bottom 0.305: v69.69,30.16 69.61,30.48 v67.43,32.66
LED1
  Top 0.2: 80.45,25.74 81.39,25.74 D1.C
  Top 0.203: U4.6 73.19,25.5 73.34,25.34 77.03,25.34 77.43,25.74 80.45,25.74
LED2
  Top 0.2: D2.C 79.68,26.19 79.28,26.19
  Top 0.203: U4.7 73.59,26.1 73.82,25.88 76.84,25.88 77.16,26.19 79.28,26.19
LED3
  Top 0.203: U4.8 74.7,26.9 75.25,26.35 76.5,26.35 77.22,27.07 78.59,27.07 D3.C
  Top 0.305: D3.C 78.43,26.9
LOG_INT  (via drill 0.35)
  Top 0.254: R13.1 11.21,3.25 v11.56,3.59 | v51.69,17.94 51.69,20.26 52.46,21.03 52.46,21.68 52.45,21.68 v52.45,22.89 | v62.36,24.78 62.11,25.03 62.06,25.03 61.88,25.22 IC1.34
  Top 0.305: 8.51,3.22 U$5.P$3 | 8.51,3.22 U$5.P$4 | R13.1 8.51,3.25 8.51,3.22
  Bottom 0.254: v11.56,3.59 11.56,5.53 22.37,16.34 22.37,16.56 22.63,16.82 42.57,16.82 43.94,18.19 51.44,18.19 v51.69,17.94 | v52.45,22.89 54.74,25.18 61.92,25.18 62.06,25.03 62.11,25.03 v62.36,24.78
MISO  (via drill 0.35, 0.5)
  Top 0.254: J10.P$2 73.35,37.22 67.91,31.78 66.11,31.78 65.85,32.04 v64.39,32.04 64.29,31.93 63.02,31.93 62.87,31.78 60.35,31.78 60.06,31.49 60.06,31.06 IC1.2 | v99.78,19.72 100.32,19.18 100.32,18.01 101.71,16.75 U3.2
  Top 0.305: U$2.7 18.5,21.25 19.35,20.4 22.94,20.4 v23.02,20.32 | U3.2 102.28,16.83 | J2.4 19.81,42.07 19.81,36.99 ISP2.1
  Bottom 0.254: v99.78,19.72 99.42,20.08 88.1,20.08 87.39,20.95 68.51,20.95 68.36,21.11 66.68,21.11 65.64,22.15 | 65.64,22.15 42.31,22.15 40.96,20.8 23.39,20.8 23.02,20.42 v23.02,20.32 | v64.39,32.04 64.53,31.89 64.53,24.29 65.64,23.18 65.64,22.15
  Bottom 0.305: ISP2.1 19.43,35.72 20.6,36.89 21.57,36.89 22.45,36 22.45,35.23 23.02,34.67 v23.02,20.32
MOSI  (via drill 0.35, 0.5, 0.5 pad 0.2)
  Top 0.254: J10.P$3 76.53,39.53 68.19,31.19 64.08,31.19 63.79,31.47 63.21,31.47 62.79,31.06 62.79,31.01 | v99.74,15.48 100.23,14.99 U3.3 | IC1.1 62.76,31.04 62.79,31.01 | v63.98,22.85 63.98,21.68 62.11,19.82 62.11,18.7 v62.06,18.65 | v63.37,29.75 62.79,30.32 62.79,31.01
  Top 0.305: v21.59,17.94 20.56,16.91 19.35,16.91 19.3,16.85 U$2.3 | 102.25,14.75 U3.3 | J2.3 22.23,39.4 ISP2.4
  Bottom 0.254: ISP2.4 20.45,38.26 19.18,36.99 17.91,36.99 17.27,36.35 17.27,21.24 20.32,17.94 v21.59,17.94 41.42,17.94 42.14,18.65 v62.06,18.65 62.47,18.65 64.14,16.99 65.25,16.99 65.88,17.62 71.71,17.62 72.82,18.73 83.23,18.73 83.85,17.94 97.28,17.94 v99.74,15.48 | v63.98,22.85 63.37,23.46 v63.37,29.75
MUX_INT  (via drill 0.35, 0.5)
  Top 0.203: U4.9 75.88,27.3 v76.04,27.15
  Top 0.254: v79.22,23.81 73.98,23.81 72.47,22.3 v70.59,22.3 | v67.87,23.2 66.98,23.2 66.14,24.05 60.88,24.05 IC1.33
  Top 0.305: R12.1 70.59,23.97 v70.59,22.3
  Bottom 0.254: v70.59,22.3 68.77,22.3 v67.87,23.2
  Bottom 0.305: v79.22,23.81 v76.04,27.15
N$1
  Top 0.305: U$3.P$10 101.29,28.63 U$8.P$2
  pour Top (rank 6, no thermals): 100.84,31.4 101.6,31.4 101.6,30.38 102.11,29.88 102.74,29.88 102.74,25.81 100.84,25.81
N$2
  Top 0.254: U$4.P$9 91.89,32.96
  Top 0.305: 91.89,32.96 91.88,32.97 91.88,33.18 L2.P$1
N$3
  Top 0.305: U$3.P$1 104.44,29.91 U$8.P$1
  pour Top (rank 6, no thermals): 102.87,31.4 103.51,31.4 105.03,29.88 105.03,25.81 103.76,25.81 103.76,30 102.87,30.89
N$4
  Top 0.305: U$3.P$6 101.46,33.34 101.46,33.51 101.67,33.72 103.28,33.72 103.51,33.94 103.51,34.79 C1.1
N$5
  Top 0.305: IC1.7 57.53,31.05 57.53,31.91 56.84,32.6 U$1.P$2 57.35,34.58 C24.2
N$6
  Top 0.305: C11.1 100.37,32.8 | 100.37,32.8 100.37,32.5 100.71,32.16 U$3.P$8 | 100.37,32.8 98.59,32.8 R1.2
  Top 0.406: R2.1 96.85,34.54 R1.2
N$7  (via drill 3.17)
  other vias: 121.68,42.78
N$8
  Top 0.305: U$1.P$1 53.14,33.12 53.72,32.67 56.13,32.67 57.02,31.78 57.02,31.06 IC1.8 | 52.97,34.23 U$1.P$1 | C25.2 52.29,33.34 U$1.P$1
N$11  (via drill 3.17)
  other vias: 2.46,42.78
N$12  (via drill 3.17)
  other vias: 2.54,2.7
N$13
  Top 0.254: U$7.27 U$7.26
N$14
  Top 1.27: Q5.3 F1.1
N$17
  Top 0.254: R28.1 35.92,12.41 C12.B2
N$18  (1 unrouted)
  Top 0.406: F2.1 81.09,22.83 83.2,24.94 84.16,24.94
N$19
  Top 0.254: C29.B1 29.34,11.74 29.34,12.02 28.58,12.78 R19.1
N$20
  Top 0.254: R16.1 80.78,13.52 80.78,12.89 83.61,10.06 86.07,10.06 92.17,16.03 94.62,16.03 95.88,17.3 U$6.9
N$21
  Top 0.254: U$6.12 92.52,21.18 92.52,17.16 85.88,10.52 83.8,10.52 83.61,10.71 83.61,12.98 R17.1
N$22
  Top 0.254: C22.1 30.11,36.91 31.07,36.91 31.68,36.3 U$10.1
N$23
  Top 0.254: U$10.5 U$10.6 31.97,31.59 33,31.59 | C23.1 33,34.39 33,31.59 | 33,31.59 U$7.23
N$24
  Top 0.254: R26.1 30.73,11.8 C29.A1
N$25
  Top 0.254: R10.2 47.2,32.71 U2.17
N$28
  Top 1.27: X1.P arc-90 121.22,4.99 U3.9
N$30
  Top 0.2: R21.2 85.59,26.3 85.59,25.47 86.34,24.72 86.34,24.18 Q6.1 86.34,23.93 Q1.3
N$31  (via drill 0.5)  (1 unrouted)
  Top 0.406: RTC1.6 80.65,10.95 v83.82,7.78
  Bottom 0.406: v83.82,7.78 85.41,9.37 BT1.POWER0
N$32
  Top 0.2: D1.A R23.1
N$33
  Top 0.2: D2.A R24.1
N$34
  Top 0.2: D3.A R25.1
N$35
  Top 0.254: U2.1 45.21,35.21 45.61,35.61 46.76,35.61 R7.2
N$36  (via drill 0.35)
  Top 0.305: MICRO_USB.3 7.58,31.53 CX3.2 8.29,30.89 v9.65,30.89 | v11.43,33.05 11.81,33.43 D+.2
  Bottom 0.305: v9.65,30.89 11.43,32.67 v11.43,33.05
N$37
  Top 0.305: MICRO_USB.2 9.85,32.18 CX2.2 12.45,30.85 D-.2
N$38  (via drill 0.35)
  Top 0.254: 14.99,33.43 D+.1 16.86,33.43 17.52,32.77 23.31,32.77 24.2,31.89 v24.29,31.89 | U2.8 41.87,33.25 41.13,33.25 40.75,33.63 v40.59,33.63
  Bottom 0.254: v40.59,33.63 36.44,33.63 35.33,34.74 26.62,34.74 25.02,33.13 25.02,33.05 25.02,32.67 24.29,31.94 v24.29,31.89
N$39  (via drill 0.35)
  Top 0.254: U2.20 v45.91,34.9 v45.9,34.9 | U2.11 42.91,31.74 42.44,32.21 U2.10 41.13,32.21 40.93,32.02 C14.1 40.89,29.5 40.89,28.86 41.38,28.37 41.38,27.92 41.8,27.5 42.8,27.5 44.03,28.73 v44.27,28.73
  Bottom 0.254: v45.9,34.9 45.9,33.28 44.88,32.26 44.88,29.34 v44.27,28.73
N$40
  Top 0.254: 48.1,31.12 LED2.A | 48.1,31.12 48.26,31.27 | R4.2 48.39,28.76 48.82,29.2 48.82,30.39 48.1,31.12
N$41
  Top 0.254: LED2.C 47.27,32.04 48.05,32.04 48.24,32.24 48.24,35.64 47.82,36.06 41.88,36.06 41.78,35.97 41.78,35.96 41.08,35.26 41.08,33.95 41.27,33.75 41.87,33.75 U2.7
N$42
  Top 0.254: R5.2 46.68,28.69 LED1.A
N$43
  Top 0.254: LED1.C 45.02,29.75 44.41,30.36 U2.14
N$44
  Top 0.254: R15.1 24.9,13.28 26.11,12.07 27.42,12.07 C29.D1
N$45
  Top 0.254: R18.1 27,13.28 28.07,12.21 28.35,12.21 28.54,12.02 28.54,11.74 C29.C1
N$46  (via drill 0.35)
  Top 0.254: D-.1 15.62,31.4 16.54,32.31 23,32.31 23.58,31.74 23.58,31.59 24.26,30.91 v24.26,30.89 | U2.9 41.87,32.67 v40.59,32.67
  Bottom 0.254: v40.59,32.67 36.75,32.67 35.14,34.28 26.82,34.28 25.48,32.94 25.48,32.48 24.99,32 24.99,31.59 24.58,31.18 24.54,31.18 v24.26,30.89
N$48
  Top 0.254: R27.1 35.12,11.94 C12.A2
N$52
  Top 0.254: U$7.25 U$7.24
N$54
  Top 0.254: U$7.22 33.5,31.47 R47.1
  Top 0.305: R46.1 R47.1
N$56
  Top 0.203: U4.23 69.11,28.9 R11.1
RADIO_CS  (via drill 0.35, 0.5, 0.5 pad 0.2)
  Top 0.254: v66.58,22.49 65.49,23.59 63.71,23.59 v62.97,22.85 | IC1.26 57.06,24.38 57.06,23.45 57.34,23.17 57.47,23.17 v57.78,22.85
  Top 0.305: v105.41,12.86 105.41,11.83 104.54,10.95 102.31,10.95 U3.5
  Bottom 0.254: v66.58,22.49 67.64,22.49 68.66,21.48 85.74,21.52 87.7,21.52 88.42,20.64 102.54,20.64 105.41,17.77 v105.41,12.86 | v62.97,22.85 v57.78,22.85
RADIO_INT  (via drill 0.5)
  Top 0.254: v64.77,17.94 62.46,17.94 62.39,17.87 61.74,17.87 60.04,19.57 IC1.32
  Top 0.305: U3.14 105.04,14.99 104,16.02 104.03,16.02 103.7,16.03 100.39,16.03 100.01,16.41 100.01,17.3 v99.76,17.56
  Bottom 0.305: v64.77,17.94 64.93,18.1 65.09,18.13 71.47,18.13 72.58,19.24 83.47,19.24 84.14,18.45 93.65,18.45 93.85,18.46 93.86,18.45 98.87,18.45 v99.76,17.56
REF_CTRL  (via drill 0.35)
  Top 0.254: U$10.3 30.13,34.57 30.13,34.96 30.61,35.44 v30.61,36.1 | U4.2 71.59,25.39 71.05,24.85 69.79,24.85 69.6,24.66 69.6,20.35 69.6,18.45 69.95,18.09 72.87,18.09 v73.03,17.94 | v40.08,36.1 40.08,34.12 39.88,33.92 39.88,29.03 40.8,28.12 40.8,18.33 42.04,17.08 42.04,17.05 42.07,17.05 42.09,17.03 43.92,17.03 v44.07,17.18
  Bottom 0.254: v73.03,17.94 72.25,17.16 66.07,17.16 65.44,16.53 63.95,16.53 62.6,17.87 61.74,17.87 61.41,18.2 53.72,18.2 52.7,17.18 v44.07,17.18 | v30.61,36.1 v40.08,36.1
RST  (via drill 0.5)
  Top 0.254: v54.39,38.52 54.94,38.52 56.79,36.66 61.71,36.66 63.21,35.17 63.21,33.42 62.48,32.7 59.98,32.7 59.06,31.78 59.06,31.06 IC1.4
  Top 0.305: v28.83,38.16 28.26,38.73 28.26,41.12 28.73,41.59 28.73,42.54 27.07,44.21 11.52,44.21 11.12,44.61 7.37,44.61 6.39,43.64 U$9.P$4 U$9.P$3 6.81,38.39 9.4,38.39 9.83,38.81 9.83,39.62 R3.1
  Bottom 0.305: ISP2.5 26.07,38.16 v28.83,38.16 28.76,38.23 32.6,38.23 34.94,40.8 50.17,40.8 50.92,40.05 50.92,38.02 53.86,38.02 53.96,38.11 54.3,38.43 v54.39,38.52
RTC_INT  (via drill 0.5)
  Top 0.254: v60.67,16.1 60.63,16.9 60.63,17.96 59.54,19.06 IC1.31
  Top 0.305: v62.36,14.26 64.99,14.26 66.84,16.1 71.05,16.1 71.25,15.91 71.25,12.17 71.85,11.57 72.79,11.57 RTC1.3
  Bottom 0.254: v60.67,16.1 62.36,14.41 v62.36,14.26
RX
  Top 0.2: R10.1 49.51,32.52 49.51,32.01 49.91,31.61 50.47,31.61 51.03,32.16 55.95,32.16 56.49,31.62 56.49,31.09 IC1.9
RX_EXT
  Top 0.254: J9.P$7 73.52,3.97 74.78,5.22 75.82,5.22 76.56,4.49 76.56,3.45 75.19,1.92 65.07,1.92 63.54,3.45 63.54,3.92 63.18,4.29 63.18,11.91 62.07,13.01 61.41,13.01 57.6,16.82 57.6,21.39 55.73,23.26 55.11,23.26 54.6,23.76 51.45,23.76 49.96,25.26 49.96,29.05 51.95,31.04 IC1.11
SCK  (via drill 0.35, 0.5)
  Top 0.254: J10.P$4 78.6,37.78 75.5,37.78 68.15,30.43 63.84,30.43 v63.5,30.77 | v100.22,14.02 101.25,12.99 U3.4 | v62.89,19.49 64.94,21.54 v64.94,22.88 | v63.94,33.19 63.13,32.39 62.83,32.39 62.68,32.24 60.17,32.24 59.56,31.63 59.56,31.06 IC1.3
  Top 0.305: U$2.5 10,18.89 v22.23,18.89
  Top 0.406: J2.5 17.32,41.76 17.32,35.21 18.04,34.5 19.05,34.5 20.27,35.72 ISP2.3
  Bottom 0.254: v62.89,19.49 63.37,19.49 64.06,18.81 65.41,18.81 65.56,18.65 71.23,18.65 72.39,19.81 83.63,19.81 84.14,19.18 96.52,19.18 96.77,18.93 99.5,18.93 100.54,17.88 100.54,14.34 v100.22,14.02 | v64.94,22.88 64.94,23.24 64.08,24.1 64.08,30.19 v63.5,30.77
  Bottom 0.305: v22.23,18.89 22.23,18.86 22.37,18.7 41,18.68 41.81,19.49 42.17,19.49 v62.89,19.49 | 22.23,19.59 v22.23,18.89 | v63.5,30.77 63.5,32.75 v63.94,33.19 | v22.23,18.89 22.23,19.97 22.21,19.98 22.21,34.59 ISP2.3
SCL  (via drill 0.35, 0.5)
  Top 0.203: U4.25 69.45,28.1 69.45,26.99
  Top 0.254: 94.62,2.7 93.34,3.97 92.08,3.97 91.44,3.33 91.44,2.14 90.73,1.43 87.1,1.43 84.6,3.93 84.6,3.97 | 84.6,3.97 84.6,8.1 79.85,12.85 79.64,12.85 RTC1.8 78.37,14.13 78.37,15.69 78.6,15.93 79.94,15.93 80.13,16.12 80.13,16.67 | 80.13,16.67 80.13,17.39 79.94,17.59 77.5,17.59 77.05,17.14 72.72,17.14 72.22,17.63 69.54,17.63 69.04,18.13 69.04,24.24 68.21,25.07 67.56,25.07 67.45,24.96 64.26,24.96 63.24,25.99 63.24,26.99 | 80.13,16.67 80.17,16.63 R17.2 | v51.18,26.7 54.7,26.7 IC1.19 | v62.36,26.7 62.64,26.99 63.12,26.99 | 63.24,26.99 63.12,26.99 | 63.24,26.99 69.45,26.99 | 63.12,26.99 | 84.6,3.97 J9.P$10
  Top 0.305: 94.62,2.7 J1.4 | R42.1 23.45,24.87 Q9.2 23.45,22.84 v24.93,22.84
  Bottom 0.254: v51.18,26.7 v62.36,26.7
  Bottom 0.305: v24.93,22.84 24.93,23.15 47.62,23.15 v51.18,26.7
SCL_HV
  Top 0.254: Q9.3 26.51,25.72 27.15,24.92 29.21,24.92 29.5,25.21 U$7.2
  Top 0.305: Q9.3 25.4,25.72 25.4,28.04 R9.1
SD_CS  (via drill 0.35, 0.5)
  Top 0.254: v42.42,17.81 42.42,19.74 41.25,20.9 41.25,25.76 41.71,26.21 42.36,26.21 42.66,25.91 46.52,25.91 46.8,25.63 v49.07,25.63 | IC1.13 54.69,29.7 54.27,29.7 53.81,29.24 v53.72,29.24
  Top 0.305: U$2.2 17.43,15.75 19.05,14.13 21.59,14.13 v21.59,16.67
  Bottom 0.254: v53.72,29.24 51.89,27.41 50.89,27.41 49.11,25.63 v49.07,25.63
  Bottom 0.305: v21.59,16.67 22.23,17.3 41.91,17.3 v42.42,17.81
SD_VCC  (via drill 0.5)
  Top 0.305: Q7.3 13.97,24.46 v13.97,24.29
  Bottom 0.305: v13.97,24.29 9.6,24.29 U$2.4
  other vias: 9.6,17.95
SD_VCC_CTRL  (via drill 0.5)
  Top 0.203: v70.33,25.8 70.33,26.12 U4.1
  Top 0.305: R22.2 16.19,27.88 Q7.1 16.24,26.51 17.46,26.51 22.7,21.27 23.97,21.27 v23.97,19.53 23.97,20 | v70.8,19.45 v73.82,22.38
  Bottom 0.305: v73.82,22.38 73.34,22.38 72.71,23.02 71.12,23.02 70.33,23.73 v70.33,25.8 | v23.97,19.53 24,19.37 40.69,19.37 41.93,20.48 63.13,20.48 64.24,19.37 69.85,19.37 | 69.85,19.37 69.86,19.37 | 69.85,19.37 70.01,19.45 v70.8,19.45
SDA  (via drill 0.35, 0.5)
  Top 0.203: U4.24 68.03,28.5 v67.79,28.26
  Top 0.254: RTC1.7 77.47,12.22 | 77.47,12.22 77.47,10.32 80.07,10.32 80.07,5.24 J9.P$9 80.7,2.06 83.82,2.06 85.25,0.63 90.65,0.63 J1.3 | 77.47,12.22 77.47,16.68 | v25.72,21.91 22.84,21.91 18.1,26.65 R43.1 | R16.2 79.17,16.68 77.47,16.68 | v51.18,25.69 51.71,26.22 IC1.20 | v62.36,25.74 62.61,25.49 62.65,25.49 62.84,25.3 63.12,25.3 63.92,24.51 66.33,24.51 66.55,24.29 v67.88,24.29 67.88,24.19 68.58,23.5 68.58,17.56 68.96,17.18 72.03,17.18 72.53,16.68 77.47,16.68
  Top 0.305: R43.1 19.8,27.88 Q8.2
  Bottom 0.254: v51.18,25.69 51.24,25.74 v62.36,25.74
  Bottom 0.305: v67.79,28.26 68.98,27.07 68.98,24.29 v67.88,24.29 | v25.72,21.91 26.45,22.64 48.13,22.64 v51.18,25.69
SDA_HV
  Top 0.254: R8.1 24.45,28.04 24.45,24.45 29.53,24.45 30,24.92 U$7.3
  Top 0.305: Q8.3 21.9,28.04 R8.1
SPI_EXT_CS1  (via drill 0.5)
  Top 0.203: 76.2,36.99 75.88,36.99 73.82,34.92 73.82,31.43 73.19,30.8 U4.16
  Top 0.305: 76.2,36.99 v76.2,36.97
  Bottom 0.305: v76.2,36.97 76.2,38.4 75.59,39.01 75.59,42.67 74.3,43.81 16.35,43.81 J2.6
SPI_EXT_CS2  (via drill 0.5)
  Top 0.203: U4.14 74.86,29.3 v75.56,30
  Bottom 0.305: v75.56,30 77.83,30 J10.P$6
TX  (via drill 0.35)
  Top 0.2: v51.12,31.21 51.47,31.21 51.99,31.72 55.78,31.72 56.02,31.49 56.02,31.06
  Top 0.254: R7.1 50.19,33.88 v50.19,32.29 | 56.02,31.06 IC1.10
  Bottom 0.254: v50.19,32.29 50.19,32.14 v51.12,31.21
TX_EXT
  Top 0.254: IC1.12 51.78,30.22 50.42,28.86 50.42,25.45 51.64,24.22 54.79,24.22 55.3,23.71 55.92,23.71 58.06,21.58 58.06,17.01 61.6,13.47 64.16,13.47 64.45,13.18 64.45,6.83 67.04,4.23 67.04,3.45 67.78,2.71 74.02,2.71 75.27,3.97 J9.P$8
VUSB  (via drill 0.35)
  Top 0.254: v42.09,28.21 42.55,28.67 43.32,28.67 43.51,28.86 43.51,29.95 | 43.51,29.95 43.51,30.13 43.41,30.24 U2.12 | 43.51,29.95 44.13,29.95 45.47,28.61 45.47,27.8 46.35,26.92 R5.1 R4.1
  Top 0.305: MICRO_USB.1 7.4,32.83 C13.A 10.37,33.81 C17.1 16.49,34.36 17.6,33.25 24.09,33.25 v24.29,33.03
  Bottom 0.305: v24.29,33.03 24.54,33.25 24.54,33.33 26.43,35.22 35.53,35.22 36.39,34.36 40.98,34.36 41.19,34.15 41.19,29.11 v42.09,28.21

## Text on the board
tDocu: SPI | A6 | A7 | A8 | A9 | A10 | A11 | D0 | D1 | D2 | D3 | GND | DI | DO | SCK | 3V3 | CS2 | D6 | 3V3 | 5V | GND | VIN | RESET | ISP | GND | A0 | 3V3 | A1 | 3V3 | A2 | GND | A3 | 3V3 | A4 | 3V3 | A5 | INT1 | 5V | 3V3 | GND | RX | TX | SDA | SCL | LOG | I2C